# EAGLE design RotaryEncoderModule_r1_1 (EAGLE 7.7.0)
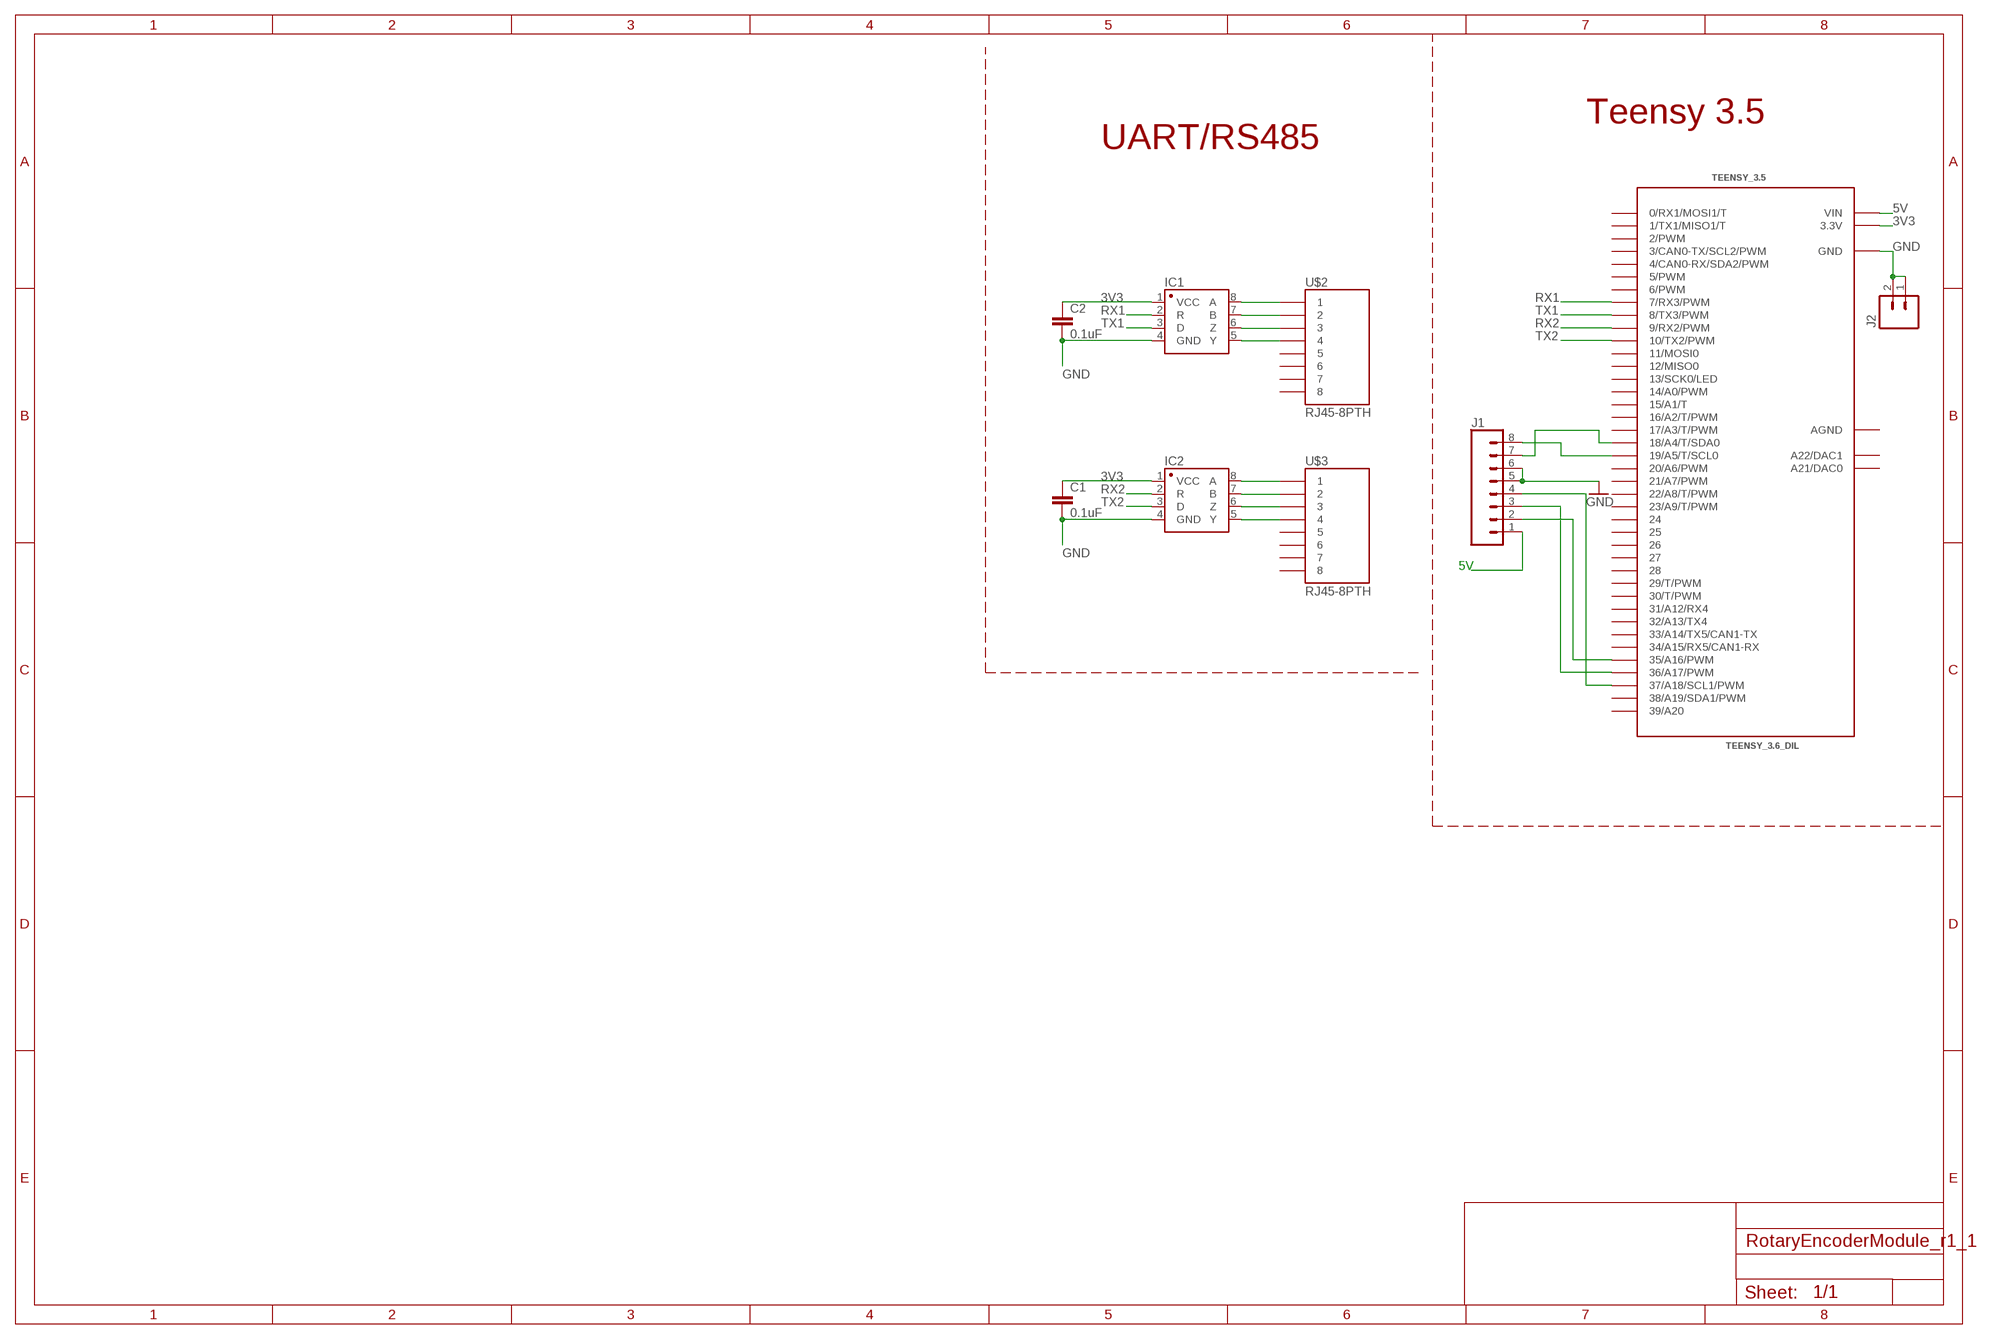
[diagram p0: schematic, sheet 1]

## Parts
C1  0.1uF  1.0UF-1206-50V-10%  [1206]
C2  0.1uF  1.0UF-1206-50V-10%  [1206]
IC1  SN65HVD31DR  [SO08]
IC2  SN65HVD31DR  [SO08]
J1  CONN_083.5MM-8  [SCREWTERMINAL-3.5MM-8]
J2  M023.5MM  [SCREWTERMINAL-3.5MM-2]
TEENSY_3.5  TEENSY_3.6_DIL  [TEENSY_3.6_DIL]
U$2  RJ45-8PTH  [RJ45-8]
U$3  RJ45-8PTH  [RJ45-8]

## Nets
3V3: C1.1 C2.1 IC1.1(VCC) IC2.1(VCC) TEENSY_3.5.3.3V TEENSY_3.5.3.3V3(3.3V)
5V: J1.1 TEENSY_3.5.VIN
GND: C1.2 C2.2 IC1.4(GND) IC2.4(GND) J1.5 J1.6 J2.1 J2.2 TEENSY_3.5.GND TEENSY_3.5.GND1(GND)
N$1: IC1.6(Z) U$2.3
N$3: IC1.8(A) U$2.1
N$4: IC1.5(Y) U$2.4
N$5: IC1.7(B) U$2.2
N$6: IC2.6(Z) U$3.3
N$7: IC2.5(Y) U$3.4
N$8: IC2.8(A) U$3.1
N$9: IC2.7(B) U$3.2
N$10: J1.8 TEENSY_3.5.19/A5(19/A5/T/SCL0)
N$11: J1.7 TEENSY_3.5.18/A4(18/A4/T/SDA0)
N$12: J1.2 TEENSY_3.5.35/A16(35/A16/PWM)
N$13: J1.3 TEENSY_3.5.36/A17(36/A17/PWM)
N$14: J1.4 TEENSY_3.5.37/A18(37/A18/SCL1/PWM)
RX1: IC1.2(R) TEENSY_3.5.7(7/RX3/PWM)
RX2: IC2.2(R) TEENSY_3.5.9(9/RX2/PWM)
TX1: IC1.3(D) TEENSY_3.5.8(8/TX3/PWM)
TX2: IC2.3(D) TEENSY_3.5.10(10/TX2/PWM)
Unconnected: TEENSY_3.5.0(0/RX1/MOSI1/T) TEENSY_3.5.1(1/TX1/MISO1/T) TEENSY_3.5.2(2/PWM) TEENSY_3.5.3(3/CAN0-TX/SCL2/PWM) TEENSY_3.5.4(4/CAN0-RX/SDA2/PWM) TEENSY_3.5.5(5/PWM) TEENSY_3.5.6(6/PWM) TEENSY_3.5.11(11/MOSI0) TEENSY_3.5.12(12/MISO0) TEENSY_3.5.13(13/SCK0/LED) TEENSY_3.5.14/A0(14/A0/PWM) TEENSY_3.5.15/A1(15/A1/T) TEENSY_3.5.16/A2(16/A2/T/PWM) TEENSY_3.5.17/A3(17/A3/T/PWM) TEENSY_3.5.20/A6(20/A6/PWM) TEENSY_3.5.21/A7(21/A7/PWM) TEENSY_3.5.22/A8(22/A8/T/PWM) TEENSY_3.5.23/A9(23/A9/T/PWM) TEENSY_3.5.24 TEENSY_3.5.25 TEENSY_3.5.26 TEENSY_3.5.27 TEENSY_3.5.28 TEENSY_3.5.29(29/T/PWM) TEENSY_3.5.30(30/T/PWM) TEENSY_3.5.31/A12(31/A12/RX4) TEENSY_3.5.32/A13(32/A13/TX4) TEENSY_3.5.33/A14(33/A14/TX5/CAN1-TX) TEENSY_3.5.34/A15(34/A15/RX5/CAN1-RX) TEENSY_3.5.38/A19(38/A19/SDA1/PWM) TEENSY_3.5.39/A20 TEENSY_3.5.A21(A21/DAC0) TEENSY_3.5.A22(A22/DAC1) U$2.5 U$2.6 U$2.7 U$2.8 U$3.5 U$3.6 U$3.7 U$3.8

## Notes on the sheet
- Teensy 3.5
- UART/RS485
- 5V

## Power pins joined to a net without a drawn wire
AGND: TEENSY_3.5.AGND

## Library data of the parts
C1 C2 = SparkFun-Capacitors:1.0UF: 1µF ceramic capacitors A capacitor is a passive two-terminal electrical component used to store electrical energy temporarily in an electric field.; PROD_ID: CAP-09822; VALUE: 1.0uF
IC1 IC2 = Joshparts4:SN65HVD31DR: A placeholder for generic narrow & wide SOIC8 foorptints - used on the DIP adapter board.
J1 = SparkFun-Connectors:CONN_08: Multi connection point. Often used as Generic Header-pin footprint for 0.1 inch spaced/style header connections On any of the 0.1 inch spaced packages, you can populate with these: Break Away Headers - Straight <https://www.sparkfun.com/products/116> (PRT-00116) Break Away Male Headers - Right Angle <https://www.sparkfun.com/products/553> (PRT-00553) Female Headers <https://www.sparkfun.com/products/115> (PRT-00115) Break Away Headers - Machine Pin <https://www.sparkfun.com/products/117> (PRT-00117) Break Away Female Headers - Swiss Machine Pin <https://www.sparkfun.com/products/743> (PRT-00743) Arduino Stackable Header - 8 Pin <https://www.sparkfun.com/products/9279> (PRT-09279) For SCREWTERMINALS and SPRING TERMINALS visit here: Screw Terimnals on SparkFun.com <https://www.sparkfun.com/search/results?term=Screw+Terminals> (5mm/3.5mm/2.54mm spacing) This device is also useful as a general connection point to wire up your design to another part of your project. Our various solder wires solder well into these plated through hole pads. Hook-Up Wire - Assortment (Stranded, 22 AWG) <https://www.sparkfun.com/products/11375> (PRT-11375) Hook-Up Wire - Assortment (Solid Core, 22 AWG) <https://www.sparkfun.com/products/11367> (PRT-11367) View the entire wire category on our website here <https://www.sparkfun.com/categories/141> Special notes: Molex polarized connector foot print use with SKU : PRT-08231 with associated crimp pins and housings. 1MM SMD Version SKU: PRT-10208 NOTES ON THE VARIANTS LOCK and LOCK_LONGPADS... This footprint was designed to help hold the alignment of a through-hole component (i.e. 6-pin header) while soldering it into place. You may notice that each hole has been shifted either up or down by 0.005 of an inch from it's more standard position (which is a perfectly straight line). This slight alteration caused the pins (the squares in the middle) to touch the edges of the holes. Because they are alternating, it causes a "brace" to hold the component in place. 0.005 has proven to be the perfect amount of "off-center" position when using our standard breakaway headers. Although looks a little odd when you look at the bare footprint, once you have a header in there, the alteration is very hard to notice. Also,if you push a header all the way into place, it is covered up entirely on the bottom side.
J2 = SparkFun-Connectors:M02: Standard 2-pin 0.1" header. Use with - straight break away headers ( PRT-00116) - right angle break away headers (PRT-00553) - swiss pins (PRT-00743) - machine pins (PRT-00117) - female headers (PRT-00115) Molex polarized connector foot print use with: PRT-08233 with associated crimp pins and housings. 2.54_SCREWTERM for use with PRT-10571. 3.5mm Screw Terminal footprints for PRT-08084 5mm Screw Terminal footprints for use with PRT-08432; PROD_ID: CONN-08399
TEENSY_3.5 = Teensy_3_and_LC_Series_Boards_v1.4:TEENSY_3.6_DIL: Teensy 3.6 DIL Package
U$2 U$3 = SparkFun:RJ45-8: RJ45 Jack Simple RJ45, 8-pin connection - connector for common Cat5, Cat5e, and Cat6 Ethernet cables. Footprint not yet proven in production. Connector sku is PRT-00643; Breakout PCB sku is BOB-00716.

## Board
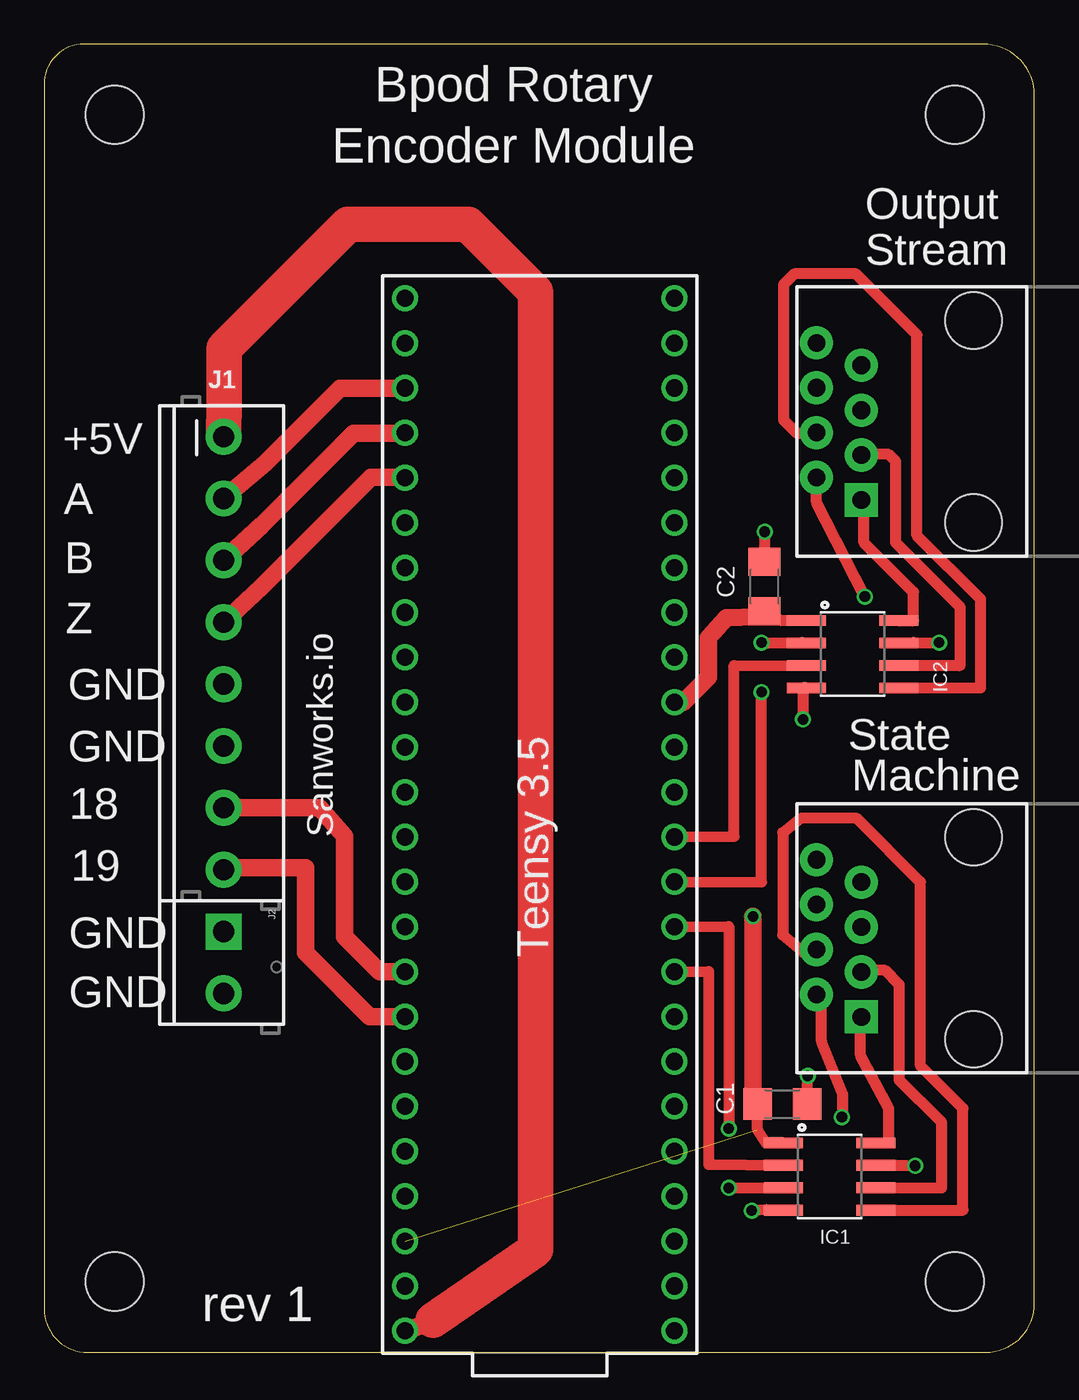
[diagram p1: board, top side]
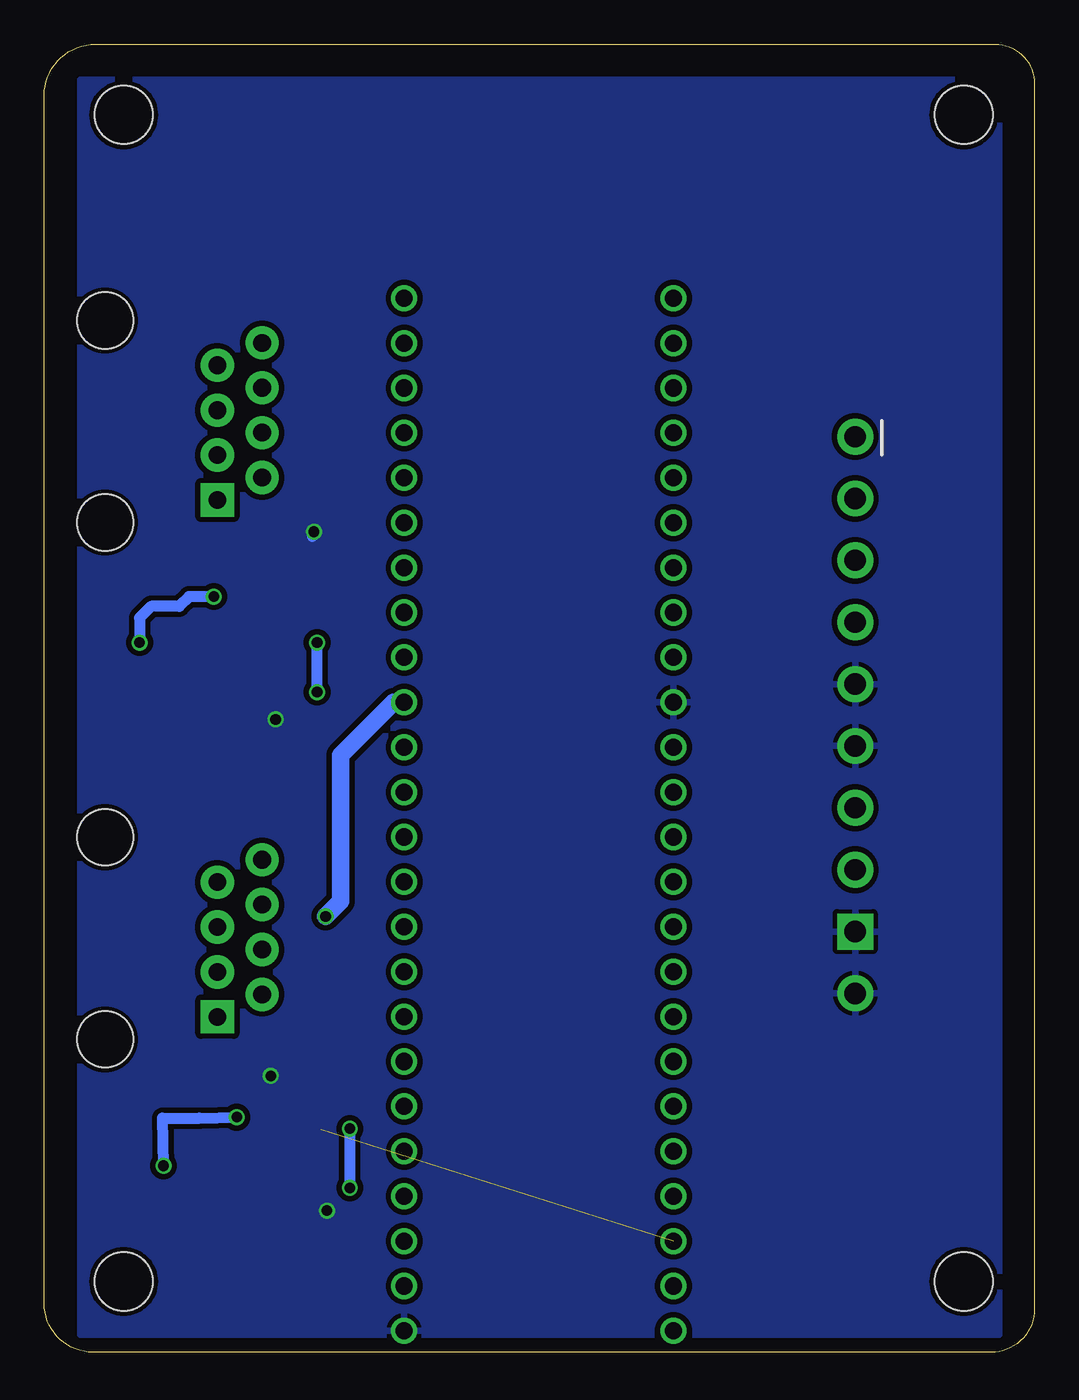
[diagram p2: board, bottom side, seen from below]

Size 56.05 x 74 mm. Coordinates in mm from the lower left corner, seen from the top.
Outline: 0,71.76 0,2.45 arc90 2.45,0 53.29,0 arc90 56.05,2.76 56.05,71.1 arc90 53.15,74 2.24,74 arc90 0,71.76
Copper layers (1*16): Top 0.035mm / dielectric 1.5mm / Bottom 0.035mm
Design rules "SeeedStudio_2layer_DRU_no_angle_20140221 *": minimum track width 6mil, minimum drill 12mil, track to track 12mil, track to pad 12mil, pad to pad 12mil, via to via 12mil, smd to smd 0mil, copper to edge 10mil, drill to drill 10mil, minimum pad ring 10mil, minimum via ring 6mil, stop-mask expansion 2mil, vias tented up to drill 100mil, thermal gap 10mil

### Footprints (pad centres in the part's own frame; a part is rotated, then mirrored left to right if it is on the bottom)
1206 = smd 1.6 x 1.8: 1 -1.4,0; 2 1.4,0
SO08 = smd 0.61 x 2.21: 1 -1.905,-2.616; 2 -0.635,-2.616; 3 0.635,-2.616; 4 1.905,-2.616; 5 1.905,2.616; 6 0.635,2.616; 7 -0.635,2.616; 8 -1.905,2.616
SCREWTERMINAL-3.5MM-8 = drill 1.2 pad 2.032: 1 0,0; 2 3.5,0; 3 7,0; 4 10.5,0; 5 14,0; 6 17.5,0; 7 21,0; 8 24.5,0
SCREWTERMINAL-3.5MM-2 = drill 1.2 pad 2.032 square: 1 0,0 | drill 1.2 pad 2.032: 2 3.5,0
TEENSY_3.6_DIL = drill 0.965: 0 -7.62,25.4; 1 -7.62,22.86; 2 -7.62,20.32; 3 -7.62,17.78; 3.3V 7.62,22.86; 3.3V3 -7.62,-7.62; 4 -7.62,15.24; 5 -7.62,12.7; 6 -7.62,10.16; 7 -7.62,7.62; 8 -7.62,5.08; 9 -7.62,2.54; 10 -7.62,0; 11 -7.62,-2.54; 12 -7.62,-5.08; 13 7.62,-5.08; 14/A0 7.62,-2.54; 15/A1 7.62,0; 16/A2 7.62,2.54; 17/A3 7.62,5.08; 18/A4 7.62,7.62; 19/A5 7.62,10.16; 20/A6 7.62,12.7; 21/A7 7.62,15.24; 22/A8 7.62,17.78; 23/A9 7.62,20.32; 24 -7.62,-10.16; 25 -7.62,-12.7; 26 -7.62,-15.24; 27 -7.62,-17.78; 28 -7.62,-20.32; 29 -7.62,-22.86; 30 -7.62,-25.4; 31/A12 -7.62,-27.94; 32/A13 -7.62,-30.48; 33/A14 7.62,-30.48; 34/A15 7.62,-27.94; 35/A16 7.62,-25.4; 36/A17 7.62,-22.86; 37/A18 7.62,-20.32; 38/A19 7.62,-17.78; 39/A20 7.62,-15.24; A21 7.62,-12.7; A22 7.62,-10.16; AGND 7.62,25.4; GND -7.62,27.94; GND1 7.62,-7.62; VIN 7.62,27.94
RJ45-8 = drill 1 pad 1.88 square: 1 -4.445,6.35 | drill 1 pad 1.88: 2 -3.175,8.89; 3 -1.905,6.35; 4 -0.635,8.89; 5 0.635,6.35; 6 1.905,8.89; 7 3.175,6.35; 8 4.445,8.89 | hole 3.2: -5.715,0; 5.715,0
STAND-OFF = hole 3.302: 0,0

### Placement (x,y rotation side)
C1  41.78,14.05 0 top
C2  40.77,43.32 90 top
IC1  44.46,9.94 270 top
IC2  45.76,39.49 270 top
J1  10.15,51.8 270 top
J2  10.15,23.8 270 top
TEENSY_3.5  28.05,29.15 180 top
U$2  52.6,23.42 90 top
U$3  52.6,52.66 90 top
U$5  [STAND-OFF]  4,4 0 top
U$6  [STAND-OFF]  51.55,4 0 top
U$7  [STAND-OFF]  4,70 0 top
U$8  [STAND-OFF]  51.55,70 0 top

### Tracks (layer width: path | path; a pad name or v marks a point on that pad's centre or on a via)
3V3  (via drill 0.6)  (1 unrouted)
  Top 0.61: 42.94,41.4 IC2.1 42,41.4 41.66,41.42 C2.1 41.05,41.42 40.98,41.6 | 40.12,14.82 40.12,13.93 C1.1 40.38,12.6 40.85,11.85 IC1.1
  Top 1: 40.98,41.6 40.4,41.6 38.6,41.56 37.6,40.42 37.6,38.19 36.18,36.77 TEENSY_3.5.3.3V3 | v40.12,24.66 40.12,14.82
  Bottom 1: v40.12,24.66 39.26,25.52 39.26,33.78 36.27,36.77 TEENSY_3.5.3.3V3
5V
  Top 1: TEENSY_3.5.VIN 21.61,1.61 21,1.4 22,1.8
  Top 2: 22,1.8 27.8,5.8 27.8,60 24,63.8 17.2,63.8 10.2,56.8 10.2,53.85 J1.1
GND  (via drill 0.6)
  Top 0.61: C1.2 v43.22,15.63 | IC2.4 42.95,37.59 v42.95,35.8 | IC1.4 40.89,8.05 v40.05,8.02 | C2.2 40.79,44.69 v40.78,46.42
  Bottom 0.61: v40.78,46.42 40.86,46.14
  pour Bottom: 2,72 2,1 54,1 54,72
N$1
  Top 0.61: IC1.6 50.8,9.3 50.8,13 48.4,15.4 48.4,20.8 47.6,21.6 46.33,21.6 U$2.3
N$3
  Top 0.61: IC1.8 47.84,11.85 47.8,12.2 47.8,13.8 46.2,16.8 46.2,18.93 U$2.1
N$4
  Top 0.61: IC1.5 52,8.04 52,13.8 49.6,16.2 49.6,26.6 46,30.2 42.8,30.2 41.8,29.4 41.8,23.6 43,22.6 43.52,22.6 U$2.4
N$5  (via drill 0.6)
  Top 0.61: IC1.7 48.78,10.57 v49.3,10.55 | v45.15,13.3 45.2,13.35 45.2,14.6 44,17.6 44,19.95 U$2.2
  Bottom 0.61: v49.3,10.55 49.35,13.25 47.25,13.25 v45.15,13.3
N$6
  Top 0.61: IC2.6 51.7,38.85 51.85,38.85 51.85,42.15 48.2,45.8 48.2,50.4 47.8,50.8 46.3,50.8 U$3.3
N$7
  Top 0.61: IC2.5 53,37.59 53,42.6 49.4,46.2 49.4,57.55 45.95,61 42.45,61 41.85,60.4 41.85,52.75 42.6,52 43.69,52 U$3.4
N$8
  Top 0.61: IC2.8 49.19,41.4 49.2,41.4 49.2,43 46.4,45.8 46.4,48.06 U$3.1
N$9  (via drill 0.6)
  Top 0.61: IC2.7 49.2,40.15 v50.65,40.15 | v46.45,42.75 43.71,48.09 U$3.2
  Bottom 0.61: 50.7,40.2 v50.65,40.15 50.65,41.55 50,42.2 48.4,42.2 47.85,42.75 v46.45,42.75
N$10
  Top 1: TEENSY_3.5.19/A5 18.41,18.99 14.8,22.6 14.8,27.4 10.25,27.4 J1.8
N$11
  Top 1: TEENSY_3.5.18/A4 18.97,21.53 17,23.5 17,29.2 15.6,30.8 J1.7
N$12
  Top 1: J1.2 12.5,50.3 16.75,54.55 TEENSY_3.5.35/A16
N$13
  Top 1: J1.3 12.3,46.8 17.5,52 TEENSY_3.5.36/A17
N$14
  Top 1: J1.4 12.3,43.3 18.5,49.5 20.4,49.5 TEENSY_3.5.37/A18
RX1
  Top 0.61: TEENSY_3.5.7 37.6,21.55 37.6,10.62 IC1.2
RX2  (via drill 0.6)
  Top 0.61: TEENSY_3.5.9 40.6,26.59 v40.6,37.35 | v40.6,40.15 42.89,40.15 IC2.2
  Bottom 0.61: v40.6,37.35 v40.6,40.15
TX1  (via drill 0.6)
  Top 0.61: TEENSY_3.5.8 38.75,24.09 v38.75,12.65 | v38.75,9.3 41.2,9.3 IC1.3
  Bottom 0.61: v38.75,12.65 v38.75,9.3
TX2
  Top 0.61: TEENSY_3.5.10 39.05,29.18 39.05,38.85 42.74,38.85 IC2.3

### Text on the board
tPlace: Bpod Rotary | Encoder Module | Output | Stream | +5V | A | B | Z | GND | State | Machine | GND | 18 | Sanworks.io | 19 | GND | Teensy 3.5 | GND | rev 1